# EAGLE design pwr (EAGLE 9.4.2)

## Sheet 1 of 2

## Sheet 2 of 2
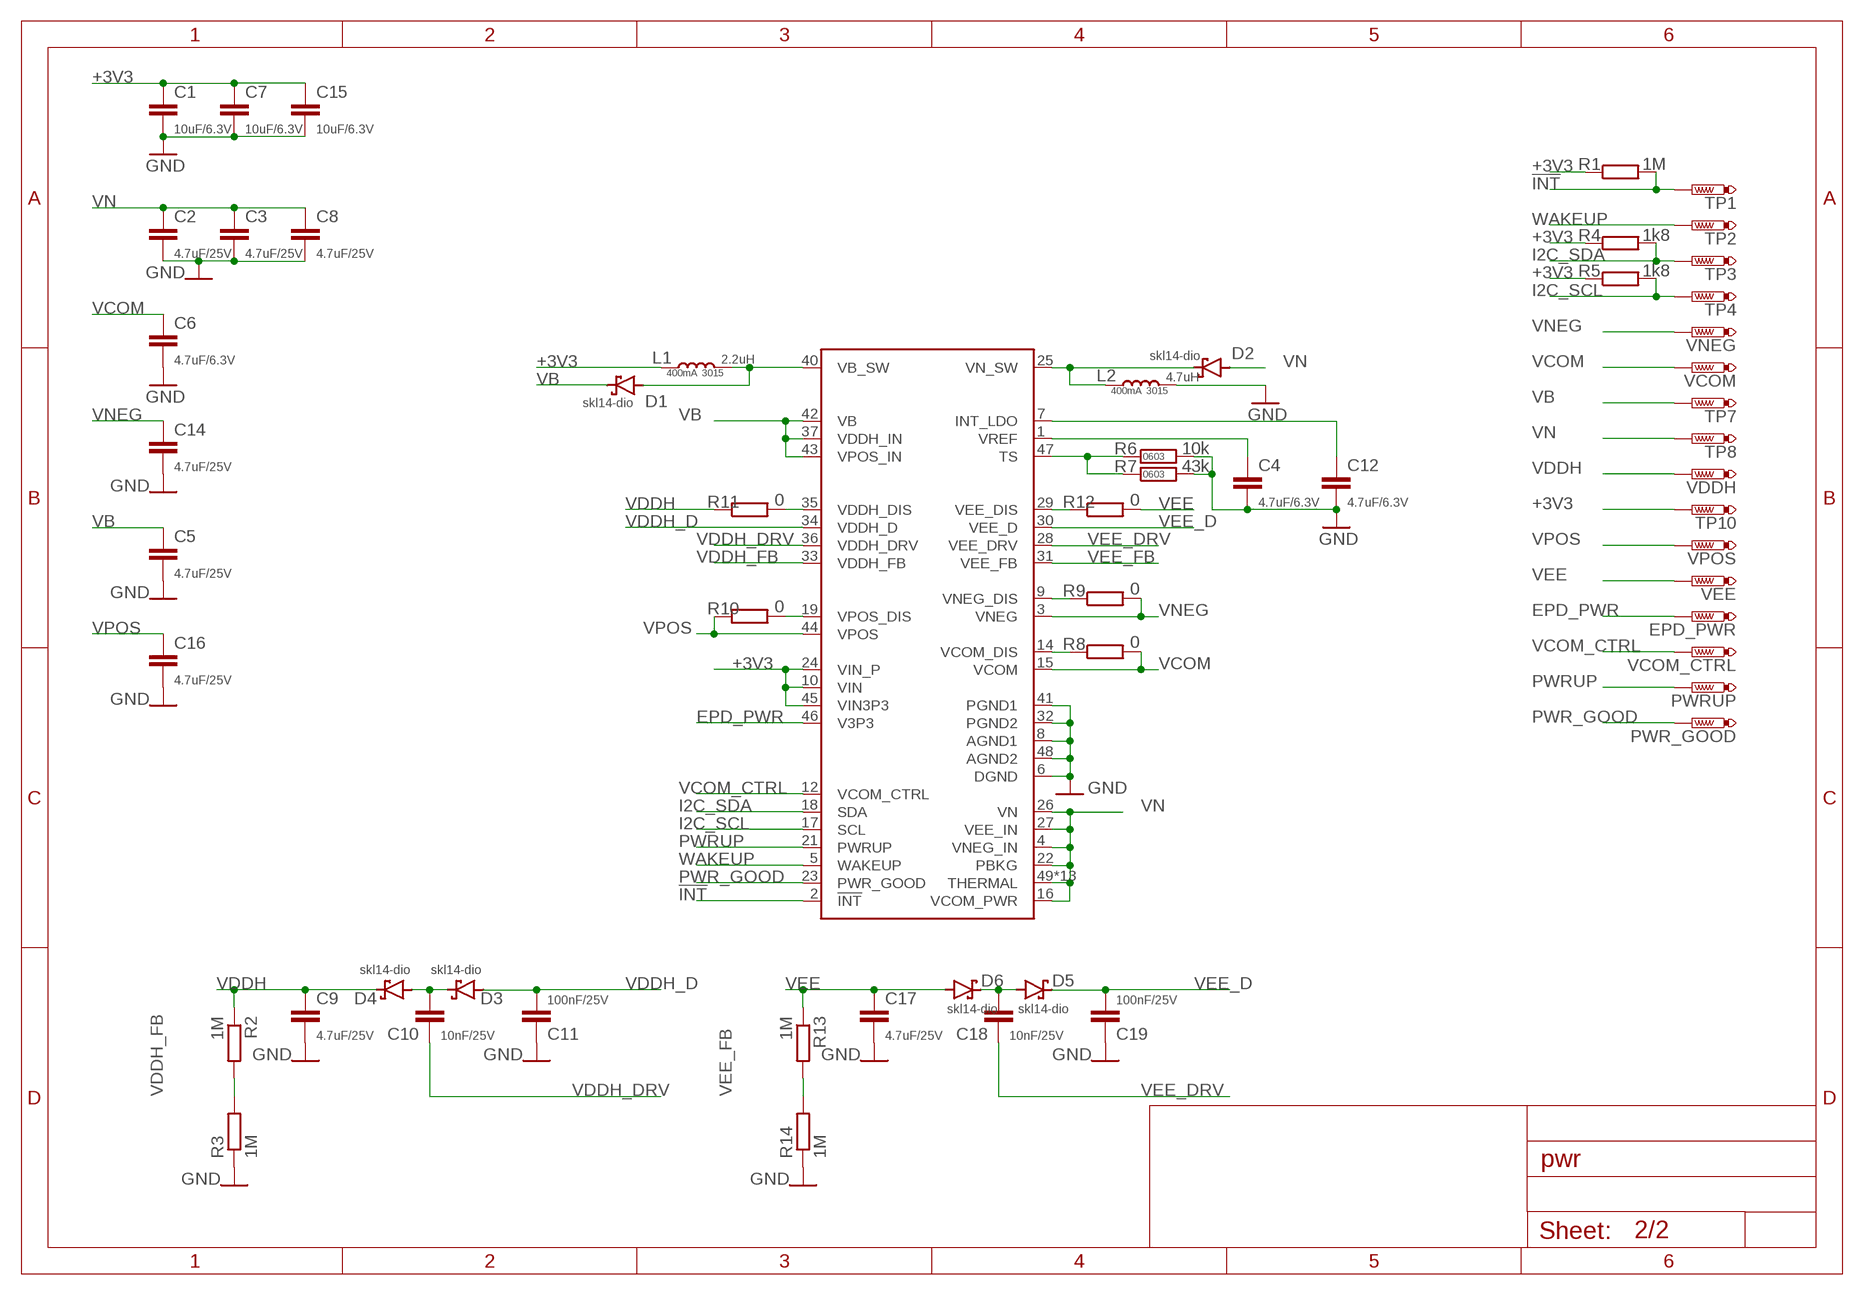
[diagram p0: schematic, sheet 2]

### Parts
C1  10uF/6.3V  C-EUC0805  [C0805]
C2  4.7uF/25V  C-EUC0805  [C0805]
C3  4.7uF/25V  C-EUC0805  [C0805]
C4  4.7uF/6.3V  C-EUC0603  [C0603]
C5  4.7uF/25V  C-EUC0805  [C0805]
C6  4.7uF/6.3V  C-EUC0603  [C0603]
C7  10uF/6.3V  C-EUC0805  [C0805]
C8  4.7uF/25V  C-EUC0805  [C0805]
C9  4.7uF/25V  C-EUC0805  [C0805]
C10  10nF/25V  C-EUC0402  [C0402]
C11  100nF/25V  C-EUC0603  [C0603]
C12  4.7uF/6.3V  C-EUC0603  [C0603]
C14  4.7uF/25V  C-EUC0805  [C0805]
C15  10uF/6.3V  C-EUC0805  [C0805]
C16  4.7uF/25V  C-EUC0805  [C0805]
C17  4.7uF/25V  C-EUC0805  [C0805]
C18  10nF/25V  C-EUC0402  [C0402]
C19  100nF/25V  C-EUC0603  [C0603]
D1  skl14-dio  SKL14  [SODFL3718X130]
D2  skl14-dio  SKL14  [SODFL3718X130]
D3  skl14-dio  SKL14  [SODFL3718X130]
D4  skl14-dio  SKL14  [SODFL3718X130]
D5  skl14-dio  SKL14  [SODFL3718X130]
D6  skl14-dio  SKL14  [SODFL3718X130]
EPD_PWR  PTR1B1,27  [B1,27]
L1  2.2uH  DJNR3015  [L3230M]
L2  4.7uH  DJNR3015  [L3230M]
PWR_GOOD  PTR1B1,27  [B1,27]
PWRUP  PTR1B1,27  [B1,27]
R1  1M  R-EU_R0603  [R0603]
R2  1M  R-EU_R0603  [R0603]
R3  1M  R-EU_R0603  [R0603]
R4  1k8  R-EU_R0603  [R0603]
R5  1k8  R-EU_R0603  [R0603]
R6  10k  RES-0603  [R0603]
R7  43k  RES-0603  [R0603]
R8  0  R-EU_R0402  [R0402]
R9  0  R-EU_R0402  [R0402]
R10  0  R-EU_R0402  [R0402]
R11  0  R-EU_R0402  [R0402]
R12  0  R-EU_R0402  [R0402]
R13  1M  R-EU_R0603  [R0603]
R14  1M  R-EU_R0603  [R0603]
TP1  PTR1B1,27  [B1,27]
TP2  PTR1B1,27  [B1,27]
TP3  PTR1B1,27  [B1,27]
TP4  PTR1B1,27  [B1,27]
TP7  PTR1B1,27  [B1,27]
TP8  PTR1B1,27  [B1,27]
TP10  PTR1B1,27  [B1,27]
U1  TPS65185  [QFN50P700X700X100-49T410]
VCOM  PTR1B1,27  [B1,27]
VCOM_CTRL  PTR1B1,27  [B1,27]
VDDH  PTR1B1,27  [B1,27]
VEE  PTR1B1,27  [B1,27]
VNEG  PTR1B1,27  [B1,27]
VPOS  PTR1B1,27  [B1,27]

### Nets
!INT: R1.2 TP1.TP U1.2(!INT)
+3V3: C1.1 C7.1 C15.1 L1.1 R1.1 R4.1 R5.1 TP10.TP U1.10(VIN) U1.24(VIN_P) U1.45(VIN3P3)
EPD_PWR: EPD_PWR.TP U1.46(V3P3)
GND: C1.2 C2.2 C3.2 C4.2 C5.2 C6.2 C7.2 C8.2 C9.2 C11.2 C12.2 C14.2 C15.2 C16.2 C17.2 C19.2 L2.2 R3.1 R6.2 R7.2 R14.1 U1.6(DGND) U1.8(AGND1) U1.32(PGND2) U1.41(PGND1) U1.48(AGND2)
I2C_SCL: R5.2 TP4.TP U1.17(SCL)
I2C_SDA: R4.2 TP3.TP U1.18(SDA)
N$1: C12.1 U1.7(INT_LDO)
N$2: D1.A L1.2 U1.40(VB_SW)
N$3: D2.C L2.1 U1.25(VN_SW)
N$4: C4.1 U1.1(VREF)
N$5: R6.1 R7.1 U1.47(TS)
N$6: C10.1 D3.C D4.A
N$7: R8.1 U1.14(VCOM_DIS)
N$8: C18.1 D5.A D6.C
N$9: R9.1 U1.9(VNEG_DIS)
N$11: R10.2 U1.19(VPOS_DIS)
N$14: R12.1 U1.29(VEE_DIS)
N$15: R11.2 U1.35(VDDH_DIS)
PWR_GOOD: PWR_GOOD.TP U1.23(PWR_GOOD)
PWRUP: PWRUP.TP U1.21(PWRUP)
VB: C5.1 D1.C TP7.TP U1.37(VDDH_IN) U1.42(VB) U1.43(VPOS_IN)
VCOM: C6.1 R8.2 U1.15(VCOM) VCOM.TP
VCOM_CTRL: U1.12(VCOM_CTRL) VCOM_CTRL.TP
VDDH: C9.1 D4.C R2.1 R11.1 VDDH.TP
VDDH_D: C11.1 D3.A U1.34(VDDH_D)
VDDH_DRV: C10.2 U1.36(VDDH_DRV)
VDDH_FB: R2.2 R3.2 U1.33(VDDH_FB)
VEE: C17.1 D6.A R12.2 R13.1 VEE.TP
VEE_D: C19.1 D5.C U1.30(VEE_D)
VEE_DRV: C18.2 U1.28(VEE_DRV)
VEE_FB: R13.2 R14.2 U1.31(VEE_FB)
VN: C2.1 C3.1 C8.1 D2.A TP8.TP U1.4(VNEG_IN) U1.16(VCOM_PWR) U1.22(PBKG) U1.26(VN) U1.27(VEE_IN) U1.49(THERMAL) U1.P$1(THERMAL) U1.P$2(THERMAL) U1.P$3(THERMAL) U1.P$4(THERMAL) U1.P$5(THERMAL) U1.P$6(THERMAL) U1.P$7(THERMAL) U1.P$8(THERMAL) U1.P$9(THERMAL) U1.P$10(THERMAL) U1.P$11(THERMAL) U1.P$12(THERMAL)
VNEG: C14.1 R9.2 U1.3(VNEG) VNEG.TP
VPOS: C16.1 R10.1 U1.44(VPOS) VPOS.TP
WAKEUP: TP2.TP U1.5(WAKEUP)

## Library data of the parts
C1-C12 C14-C19 = rcl:C-EU: CAPACITOR, European symbol; SPICEPREFIX: C
D1-D6 = parts-diotec:SKL
EPD_PWR PWR_GOOD PWRUP TP1-TP4 TP7 TP8 TP10 VCOM VCOM_CTRL VDDH VEE VNEG VPOS = testpad:PTR1: TEST PIN
L1 L2 = parts-ferrocore:DJNR3015; CURRENT: 400mA; PACKAGE: 3015
R1-R5 R8-R14 = rcl:R-EU_: RESISTOR, European symbol; SPICEPREFIX: R
R6 R7 = parts-passives:RES-; PACKAGE: 0603
U1 = parts-ti:TPS65185

## Board
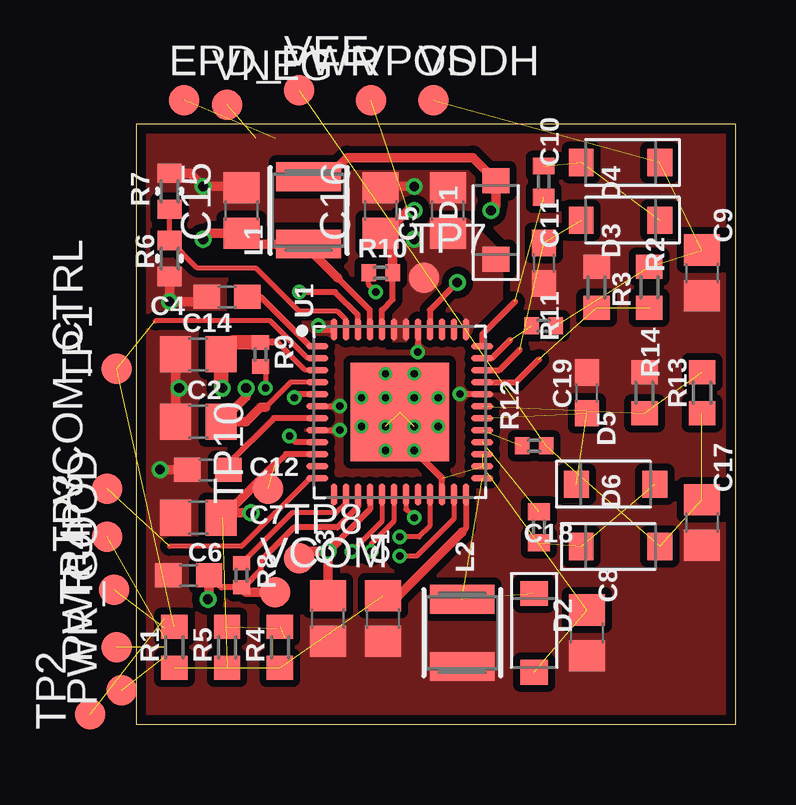
[diagram p1: board, top side]
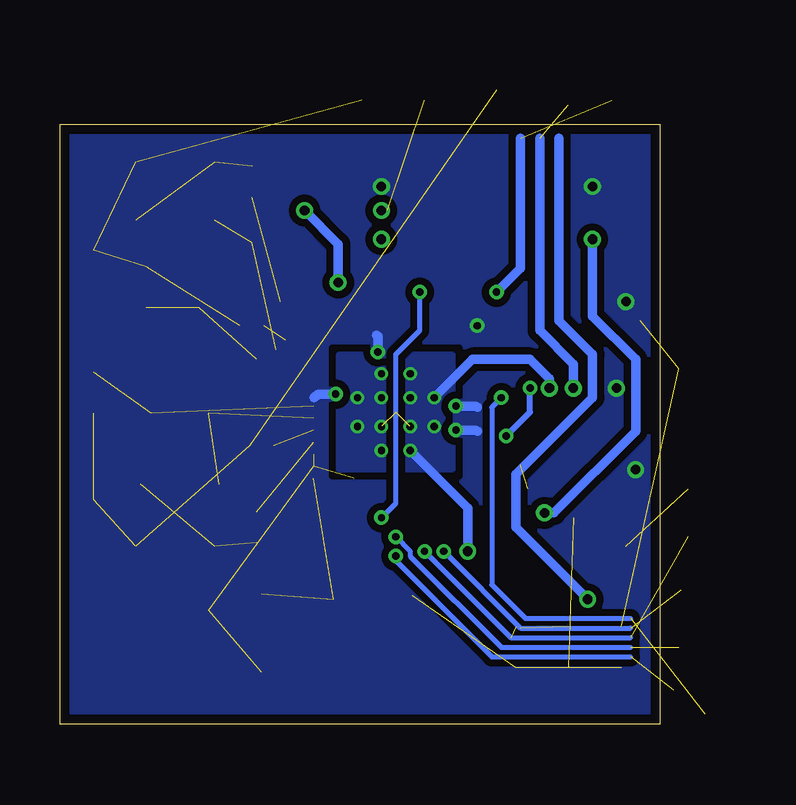
[diagram p2: board, bottom side, seen from below]

Size 25 x 25 mm. Coordinates in mm from the lower left corner, seen from the top.
Outline: 0,0 25,0 25,25 0,25 0,0
Copper layers (1*16): Top 0.035mm / dielectric 1.5mm / Bottom 0.035mm
Design rules "default *": minimum track width 5mil, minimum drill 0.3mm, track to track 6mil, track to pad 6mil, pad to pad 6mil, via to via 6mil, smd to smd 6mil, copper to edge 0.4mm, drill to drill 6mil, minimum pad ring 5mil, minimum via ring 6mil, stop-mask expansion 4mil, vias tented up to drill 0.4mm, thermal gap 10mil

### Footprints (pad centres in the part's own frame; a part is rotated, then mirrored left to right if it is on the bottom)
C0805 = smd 1.3 x 1.5: 1 -0.95,0; 2 0.95,0
C0603 = smd 1.1 x 1: 1 -0.85,0; 2 0.85,0
C0402 = smd 0.7 x 0.9: 1 -0.65,0; 2 0.65,0
SODFL3718X130 = smd 1.036 x 1.129: A 1.639,0; C -1.639,0
B1,27 = smd 1.27 x 1.27: TP 0,0
L3230M = smd 1.2 x 2.7: 1 -1.4,0; 2 1.4,0
R0603 = smd 1 x 1.1: 1 -0.85,0; 2 0.85,0
R0603' = smd 0.8 x 1: 1 -0.75,0; 2 0.75,0
R0402 = smd 0.6 x 0.7: 1 -0.5,0; 2 0.5,0
QFN50P700X700X100-49T410 = smd 0.896 x 0.264: 1 -3.437,2.75; 2 -3.437,2.25; 3 -3.437,1.75; 4 -3.437,1.25; 5 -3.437,0.75; 6 -3.437,0.25; 7 -3.437,-0.25; 8 -3.437,-0.75; 9 -3.437,-1.25; 10 -3.437,-1.75; 11 -3.437,-2.25; 12 -3.437,-2.75; 25 3.437,-2.75; 26 3.437,-2.25; 27 3.437,-1.75; 28 3.437,-1.25; 29 3.437,-0.75; 30 3.437,-0.25; 31 3.437,0.25; 32 3.437,0.75; 33 3.437,1.25; 34 3.437,1.75; 35 3.437,2.25; 36 3.437,2.75 | smd 0.264 x 0.896: 13 -2.75,-3.437; 14 -2.25,-3.437; 15 -1.75,-3.437; 16 -1.25,-3.437; 17 -0.75,-3.437; 18 -0.25,-3.437; 19 0.25,-3.437; 20 0.75,-3.437; 21 1.25,-3.437; 22 1.75,-3.437; 23 2.25,-3.437; 24 2.75,-3.437; 37 2.75,3.437; 38 2.25,3.437; 39 1.75,3.437; 40 1.25,3.437; 41 0.75,3.437; 42 0.25,3.437; 43 -0.25,3.437; 44 -0.75,3.437; 45 -1.25,3.437; 46 -1.75,3.437; 47 -2.25,3.437; 48 -2.75,3.437 | smd 4.1 x 4.1: 49 0,0 | drill 0.3 pad 0.4: P$1 0.6,0.6; P$2 0.6,-0.6; P$3 -0.6,-0.6; P$4 -0.6,0.6; P$5 0.6,1.6; P$6 -0.6,1.6; P$7 1.6,0.6; P$8 1.6,-0.6; P$9 0.6,-1.6; P$10 -0.6,-1.6; P$11 -1.6,-0.6; P$12 -1.6,0.6

### Placement (x,y rotation side)
C1  10.3,4.4 270 top
C2  2.6,12.6 180 top
C3  8,4.4 270 top
C4  3.8,17.8 180 top
C5  13,21.4 90 top
C6  2.2,6.2 180 top
C7  2.6,8.6 180 top
C8  18.8,3.8 270 top
C9  23.6,18.8 270 top
C10  17,22.6 270 top
C11  17,19.2 270 top
C12  3,10.6 180 top
C14  2.6,15.4 180 top
C15  4.4,21.4 90 top
C16  10.2,21.4 90 top
C17  23.6,8.4 270 top
C18  16.8,8.2 90 top
C19  18.8,13.8 90 top
D1  15,21 90 top
D2  16.6,3.8 270 top
D3  20.2,21 180 top
D4  20.2,23.4 180 top
D5  20,10 0 top
D6  20.2,7.4 0 top
EPD_PWR  2,26 0 top
L1  7.2,21.4 90 top
L2  13.6,3.8 270 top
PWR_GOOD  -0.6,1.4 90 top
PWRUP  -0.8,3.2 90 top
R1  1.6,3.2 90 top
R2  21.4,18.2 270 top
R3  19.2,18.2 270 top
R4  6,3.2 90 top
R5  3.8,3.2 90 top
R6  10k  [R0603']  1.4,19.4 270 top
R7  43k  [R0603']  1.4,22.2 90 top
R8  4.4,6.2 270 top
R9  5.2,15.4 90 top
R10  10.2,18.8 180 top
R11  17,16.6 180 top
R12  16.6,11.6 0 top
R13  23.6,13.8 90 top
R14  21.2,13.8 270 top
TP1  -0.8,14.8 90 top
TP2  -1.9,0.4 90 top
TP3  -1.2,7.8 90 top
TP4  -0.9,5.6 90 top
TP7  12,18.6 0 top
TP8  6.8,6.9 0 top
TP10  5.5,9.8 90 top
U1  11,13 0 top
VCOM  5.8,5.5 0 top
VCOM_CTRL  -1.2,9.8 90 top
VDDH  12.4,26 0 top
VEE  6.8,26.4 0 top
VNEG  3.8,25.8 0 top
VPOS  9.8,26 0 top

### Tracks (layer width: path | path; a pad name or v marks a point on that pad's centre or on a via)
!INT  (2 unrouted)
  Top 0.2: U1.2 7.15,15.25 5.6,16.8 0.8,16.8
+3V3  (via drill 0.4)  (5 unrouted)
  Top 0.25: U1.10 6.25,11.25 5.8,10.8 | U1.24 13.75,8.15 13.6,8 | U1.45 9.75,17.25 8.4,18.6
  Top 0.4: 5.8,10.8 3.6,8.6 C7.1 3.75,8.8 v4.8,8.8 | 13.6,8 10.95,5.35 C1.1 | 8.4,18.6 7.2,19.8 L1.1 4.85,20 C15.1 3.05,20.45 v2.8,20.2
  Bottom 0.4: v4.8,8.8 4.4,8.8 1,12.2 1,15.2 2.8,17 v2.8,20.2
EPD_PWR  (via drill 0.3)  (1 unrouted)
  Top 0.25: U1.46 9.25,17.05 8.3,18 v6.8,18
  Bottom 0.4: v6.8,18 5.8,19 5.8,24.4
GND  (via drill 0.3, 0.4)
  Top 0.25: U1.6 v8.49,13.25 | U1.8 v8.49,12.25 | U1.41 v11.75,15.51 | U1.32 v13.51,13.75
  Top 0.3: U1.48 7.76,16.44 v7.6,16.6
  Top 0.4: C4.2 2.75,17.6 v1.4,17.6 R6.2 | C14.2 1.65,14.15 v1.8,14 1.65,13.85 C2.2 | C15.2 4.35,22.4 v2.8,22.4 2.25,22.95 R7.2 | C16.2 10.25,22.4 v11.6,22.4 | C12.2 v1,10.6
  Bottom 0.4: v8.49,12.25 7.65,12.25 7.6,12.2 | v8.49,13.25 7.65,13.25 7.6,13.2 | v11.75,15.51 11.75,16.15 11.8,16.2 | v13.51,13.75 14.25,13.75 14.4,13.6
  pour Bottom (isolate 0.3, rank 6): -1,-1 -1,26 26,26 26,-1
  pour Top (isolate 0.3, rank 6, no thermals): -1,-1 -1,26 26,26 26,-1
I2C_SCL  (via drill 0.3)  (2 unrouted)
  Top 0.2: U1.17 10.25,8.45 v9,7.2
  Bottom 0.2: v9,7.2 5.8,4 1.2,4
I2C_SDA  (via drill 0.3)  (2 unrouted)
  Top 0.2: v9.8,7.2 9.8,7.5 10.75,8.45 U1.18
  Bottom 0.2: v9.8,7.2 6.2,3.6 1.2,3.6
N$1
  Top 0.25: U1.7 5.75,12.75 3.85,10.85 C12.1
N$2  (via drill 0.4)
  Top 0.25: v13.4,18.4 12.25,17.25 U1.40
  Top 0.4: L1.2 8,22.8 8.8,23.6 14.04,23.6 D1.A 15,21.6 v14.8,21.4
  Bottom 0.4: v14.8,21.4 13.4,20 v13.4,18.4
N$3  (2 unrouted)
N$4
  Top 0.25: U1.1 7.25,15.75 5.2,17.8 C4.1
N$5
  Top 0.2: U1.47 8.75,16.85 8.4,17.2 6.8,17.2 5,19 2.55,19 R6.1 R7.1
N$6  (2 unrouted)
N$7
  Top 0.2: R8.1 6.5,8.8 8.35,8.8 8.75,9.2 U1.14
N$8  (2 unrouted)
N$9  (via drill 0.3)
  Top 0.2: R9.1 5.4,14.7 v5.4,14
  Top 0.25: U1.9 6.65,11.75 v6.4,12
  Bottom 0.25: v6.4,12 5.4,13 v5.4,14
N$11  (via drill 0.3)
  Top 0.2: U1.19 11.25,8.95 v11.6,8.6 | v10,18 9.7,18.3 R10.2
  Bottom 0.2: v11.6,8.6 11,9.2 11,15.4 10,16.4 v10,18
N$14  (1 unrouted)
N$15  (1 unrouted)
  Top 0.25: U1.35 14.85,15.25 15.6,16
PWR_GOOD  (via drill 0.3)  (1 unrouted)
  Top 0.2: U1.23 13.25,8.55 11.7,7 v11,7
  Bottom 0.2: v11,7 11,6.8 7,2.8 1.2,2.8
PWRUP  (via drill 0.3)  (1 unrouted)
  Top 0.2: U1.21 12.25,8.25 11.8,7.8 v11,7.8
  Bottom 0.2: v11,7.8 10.4,7.2 10.4,7 6.6,3.2 1.2,3.2
VB  (via drill 0.4)
  other vias: 11.6,20.2
  pour Top (isolate 0.3, no thermals): 10.6,16 10.6,17 11.2,17.6 11.2,19.8 12.4,21 13.8,21 15.2,19.6 15.2,17.6 13.6,16
VCOM  (via drill 0.4)
  Top 0.25: U1.15 9.25,9.05 8.4,8.2 6.6,8.2 5.2,6.8 5.2,6.4 4.5,5.7 R8.2 3.55,5.7 C6.1
  Top 0.4: C6.1 3.05,5.25 v3,5.2 | VCOM.TP 4.6,5.5 R8.2
  Bottom 0.4: v3,5.2 6,8.2 6,10.4 2.8,13.6 2.8,15.4 4.2,16.8 4.2,24.4
VCOM_CTRL  (1 unrouted)
  Top 0.2: U1.12 7.25,10.25 4.4,7.4 1.4,7.4
VDDH  (4 unrouted)
VDDH_D  (2 unrouted)
  Top 0.25: U1.34 15.15,14.75 16,15.6
VDDH_DRV  (1 unrouted)
  Top 0.25: U1.36 14.44,16.24 15.8,17.6
VDDH_FB  (2 unrouted)
  Top 0.25: U1.33 15.85,14.25 16.8,15.2
VEE  (4 unrouted)
VEE_D  (2 unrouted)
VEE_DRV  (1 unrouted)
VEE_FB  (2 unrouted)
VN  (via drill 0.4)  (6 unrouted)
  Top 0.2: U1.4 6.45,14.25 5.4,13.2
  Top 0.25: U1.22 12.75,10.2 | U1.16 9.75,8.95 8.4,7.6
  Top 0.3: 12.75,10.2 12.75,10.25 U1.P$9
  Top 0.4: 5.4,13.2 5.2,13.2 4.6,12.6 C2.1 4.59,13.64 v4.59,14 | v8,7.2 C3.1 | 8.4,7.6 v8,7.2 | TP8.TP 7.1,7.2 v8,7.2
  Bottom 0.4: v8,7.2 8,9 U1.P$10 | v4.59,14 4.59,14.39 5.4,15.2 7.8,15.2 U1.P$12
  pour Bottom (isolate 0.3, no thermals): 8.6,10.6 8.6,15.4 13.4,15.4 13.4,10.6
VNEG  (via drill 0.4)  (1 unrouted)
  Top 0.2: U1.3 7.05,14.75 5.9,15.9
  Top 0.3: 5.9,15.9 R9.2
  Top 0.6: R9.2 4.05,15.9 C14.1 3.55,14.05 v3.6,14
  Bottom 0.4: v3.6,14 3.6,15 5,16.4 5,24.4
VPOS  (via drill 0.4)  (1 unrouted)
  Top 0.25: U1.44 10.25,17.25 10.7,17.7 R10.1 | 10.22,20.43 C16.1
  Top 0.4: R10.1 10.7,19.95 10.22,20.43 | C16.1 10.4,20.45 11.35,21.4 v11.6,21.4
WAKEUP  (via drill 0.3)  (1 unrouted)
  Top 0.25: U1.5 6.75,13.75 v6.6,13.6
  Bottom 0.2: v6.6,13.6 7,13.2 7,5.8 5.6,4.4 1.2,4.4